# EAGLE design mymote-esp8266 (EAGLE 8.2.1)
PROJECT_AUTHOR: TINKERMAN <xose.perez@gmail.com>; PROJECT_LICENSE: CC-SA-BY 3.0; PROJECT_NAME: MYMOTE - ESP8266; PROJECT_VERSION: 0.1.20170507
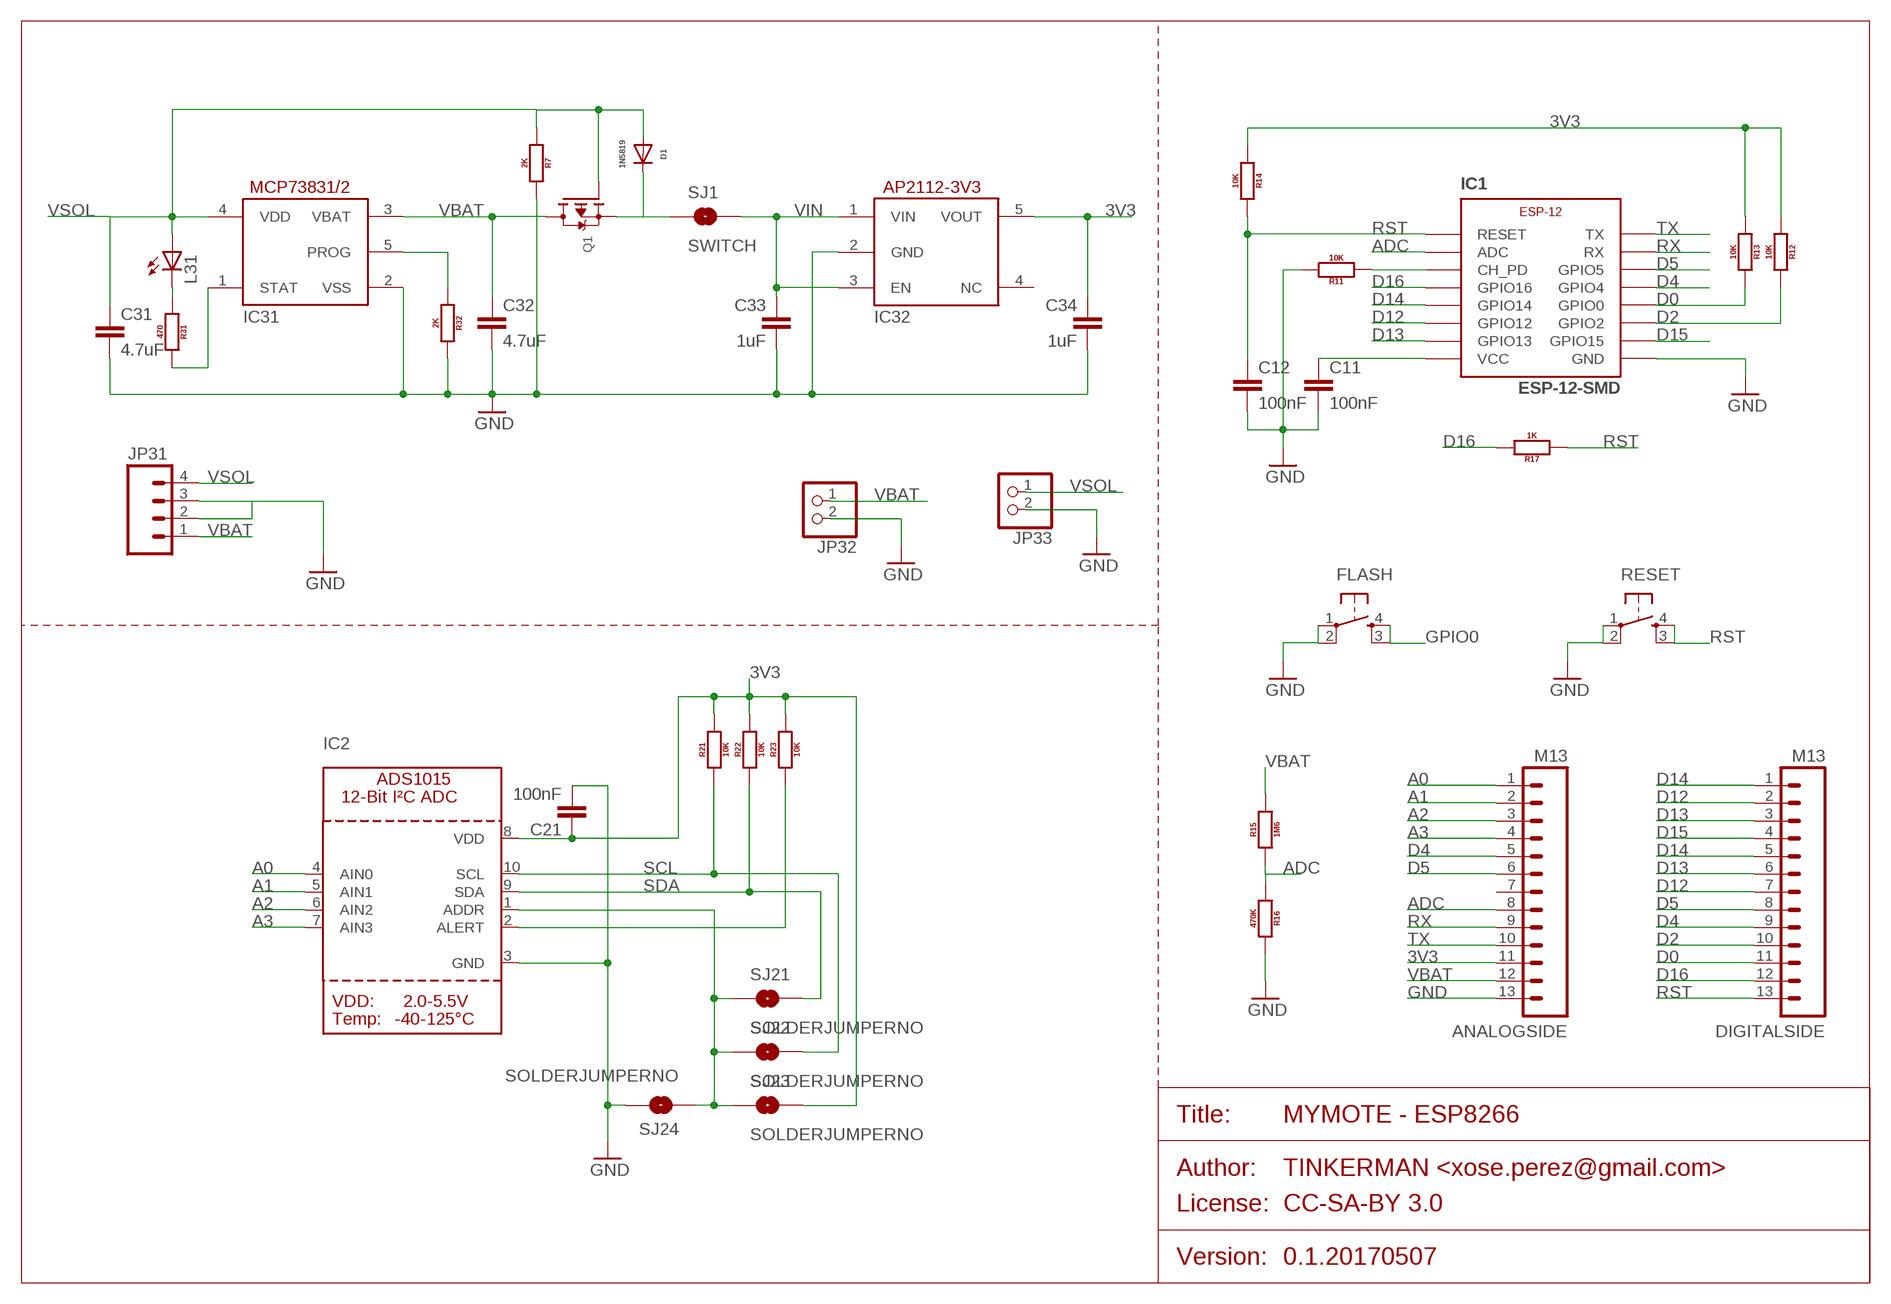
[diagram p0: schematic, sheet 1]

## Parts
ANALOGSIDE  M13  [1X13_NO_SILK]
C11  100nF  C-EU0805  [0805]
C12  100nF  C-EU0805  [0805]
C21  100nF  C-EU0805  [0805]
C31  4.7uF  C-EU0805  [0805]
C32  4.7uF  C-EU0805  [0805]
C33  1uF  C-EU0805  [0805]
C34  1uF  C-EU0805  [0805]
D1  1N5819  DIODE-SMD  [0805_DIODE]
DIGITALSIDE  M13  [1X13_NO_SILK]
FLASH  TACTILE_BUTTON_SMD  [TACTILE-BUTTON-SMD]
IC1  ESP-12-SMD  [ESP-12-SMD]
IC2  ADC_ADS1015  [MSOP10]
IC31  MCP73831/OT  [SOT23-5L]
IC32  AP2112-3V3  [SOT23-5L]
JP31  M04PTH  [1X04]
JP32  JST_2PIN-SMT-RA  [JST-PH-2-SMT-RA]
JP33  JST_2PIN-SMT-RA  [JST-PH-2-SMT-RA]
L31  LED_0805  [0805_DIODE]
Q1  MOSFET-PWIDE  [SOT23-WIDE]
R7  2K  RESISTOR0805  [0805]
R11  10K  RESISTOR0805  [0805]
R12  10K  RESISTOR0805  [0805]
R13  10K  RESISTOR0805  [0805]
R14  10K  RESISTOR0805  [0805]
R15  1M6  RESISTOR0805  [0805]
R16  470K  RESISTOR0805  [0805]
R17  1K  RESISTOR0805  [0805]
R21  10K  RESISTOR0805  [0805]
R22  10K  RESISTOR0805  [0805]
R23  10K  RESISTOR0805  [0805]
R31  470  RESISTOR0805  [0805]
R32  2K  RESISTOR0805  [0805]
RESET  TACTILE_BUTTON_SMD  [TACTILE-BUTTON-SMD]
SJ1  SWITCH  SOLDERJUMPERTRACE-PTH  [SJ_2S-TRACE-PTH]
SJ21  SOLDERJUMPERNO  [SJ_2S-NO]
SJ22  SOLDERJUMPERNO  [SJ_2S-NO]
SJ23  SOLDERJUMPERNO  [SJ_2S-NO]
SJ24  SOLDERJUMPERNO  [SJ_2S-NO]

## Nets
3V3: ANALOGSIDE.11 C11.1 C21.1 C34.1 IC1.VCC IC2.8(VDD) IC32.5(VOUT) R12.1 R13.1 R14.1 R21.2 R22.2 R23.2 SJ23.2
A0: ANALOGSIDE.1 IC2.4(AIN0)
A1: ANALOGSIDE.2 IC2.5(AIN1)
A2: ANALOGSIDE.3 IC2.6(AIN2)
A3: ANALOGSIDE.4 IC2.7(AIN3)
ADC: ANALOGSIDE.8 IC1.ADC R15.1 R16.1
D0: DIGITALSIDE.11 IC1.GPIO0 R13.2
D2: DIGITALSIDE.10 IC1.GPIO2 R12.2
D4: ANALOGSIDE.5 DIGITALSIDE.9 IC1.GPIO4
D5: ANALOGSIDE.6 DIGITALSIDE.8 IC1.GPIO5
D12: DIGITALSIDE.2 DIGITALSIDE.7 IC1.GPIO12
D13: DIGITALSIDE.3 DIGITALSIDE.6 IC1.GPIO13
D14: DIGITALSIDE.1 DIGITALSIDE.5 IC1.GPIO14
D15: DIGITALSIDE.4 IC1.GPIO15
D16: DIGITALSIDE.12 IC1.GPIO16 R17.2
GND [power]: ANALOGSIDE.13 C11.2 C12.2 C21.2 C31.2 C32.2 C33.2 C34.2 FLASH.1(SWA1) FLASH.2(SWB1) IC1.GND IC2.3(GND) IC31.2(VSS) IC32.2(GND) JP31.2 JP31.3 JP32.2 JP33.2 R7.2 R11.2 R16.2 R32.2 RESET.1(SWA1) RESET.2(SWB1) SJ24.2
GPIO0: FLASH.3(SWB2) FLASH.4(SWA2)
N$1: IC1.CH_PD R11.1
N$2: L31.C R31.1
N$3: IC31.5(PROG) R32.1
N$4: IC31.1(STAT) R31.2
N$9: D1.C Q1.2(S) SJ1.1
N$10: IC2.2(ALERT) R23.1
N$11: IC2.1(ADDR) SJ21.1 SJ22.1 SJ23.1 SJ24.1
RST: C12.1 DIGITALSIDE.13 IC1.RESET R14.2 R17.1 RESET.3(SWB2) RESET.4(SWA2)
RX: ANALOGSIDE.9 IC1.RX
SCL: IC2.10(SCL) R21.1 SJ22.2
SDA: IC2.9(SDA) R22.1 SJ21.2
TX: ANALOGSIDE.10 IC1.TX
VBAT: ANALOGSIDE.12 C32.1 IC31.3(VBAT) JP31.1 JP32.1 Q1.3(D) R15.2
VIN: C33.1 IC32.1(VIN) IC32.3(EN) SJ1.2
VSOL: C31.1 D1.A IC31.4(VDD) JP31.4 JP33.1 L31.A Q1.1(G) R7.1
Unconnected: ANALOGSIDE.7 IC32.4(NC)

## Library data of the parts
ANALOGSIDE DIGITALSIDE = xose:M13
C11 C12 C21 C31-C34 = xose:C-EU: CAPACITOR, European symbol
D1 = xose:DIODE
FLASH RESET = xose:TACTILE_BUTTON: Tactile Button SparkFun Electronics' Tactile Button COM-10302
IC1 = xose:ESP-12
IC2 = microbuilder:ADC_ADS1015: ADS1015 - 12-bit 4-Channel I2C ADC with Internal PGA VDD: 2.0-5.5V Sampling Rate: 3.3ksps Gain Settings: 2/3, 1, 2, 4, 8, 16 I2C Address: ADDR low = 1001000x, ADDR high = 1001001x Internal Comparator The ADS1015 includes an internal comparator that can be set to output a high-level on ALERT when the conversion results exceeeds a pre-defined upper level, and will deassert itself when the level falls below a pre-defined lower threshold level. It can also be set to windowed mode where the ALERT pin will be asserted if the data exceeds the upper threshold or falls below the lower threshold.
IC31 = adafruit:MCP73831: MCP73831/2 Miniature Single-Cell, Fully Integrated Li-Ion, Li-Polymer Charge Management Controllers. Nice and small simple lipoly charge controller, with adjustable current and status output (LED) http://www.ladyada.net/library/pcb/eaglelibrary.html
IC32 = xose:AP2112-3V3
JP31 = xose:M04: Header 4 Standard 4-pin 0.1" header. Use with straight break away headers (SKU : PRT-00116), right angle break away headers (PRT-00553), swiss pins (PRT-00743), machine pins (PRT-00117), and female headers (PRT-00115). Molex polarized connector foot print use with SKU : PRT-08231 with associated crimp pins and housings. 1MM SMD Version SKU: PRT-10208
JP32 JP33 = adafruit:JST_2PIN: JST 2-Pin Connectors of various flavors SMT-RA (S2B-PH-SM4) 4UConnector #17311 SMT (B2B-PH-SM4) THM-RA (S2B-PH) THM (B2B-PH)
L31 = xose:LED: LED OSRAM: - CHIPLED LG R971, LG N971, LY N971, LG Q971, LY Q971, LO R971, LY R971 LH N974, LH R974 LS Q976, LO Q976, LY Q976 LO Q996 - Hyper CHIPLED LW Q18S LB Q993, LB Q99A, LB R99A - SideLED LS A670, LO A670, LY A670, LG A670, LP A670 LB A673, LV A673, LT A673, LW A673 LH A674 LY A675 LS A676, LA A676, LO A676, LY A676, LW A676 LS A679, LY A679, LG A679 - Hyper Micro SIDELED® LS Y876, LA Y876, LO Y876, LY Y876 LT Y87S - SmartLED LW L88C, LW L88S LB L89C, LB L89S, LG L890 LS L89K, LO L89K, LY L89K LS L896, LA L896, LO L896, LY L896 - TOPLED LS T670, LO T670, LY T670, LG T670, LP T670 LSG T670, LSP T670, LSY T670, LOP T670, LYG T670 LG T671, LOG T671, LSG T671 LB T673, LV T673, LT T673, LW T673 LH T674 LS T676, LA T676, LO T676, LY T676, LB T676, LH T676, LSB T676, LW T676 LB T67C, LV T67C, LT T67C, LS T67K, LO T67K, LY T67K, LW E67C LS E67B, LA E67B, LO E67B, LY E67B, LB E67C, LV E67C, LT E67C LW T67C LS T679, LY T679, LG T679 LS T770, LO T770, LY T770, LG T770, LP T770 LB T773, LV T773, LT T773, LW T773 LH T774 LS E675, LA E675, LY E675, LS T675 LS T776, LA T776, LO T776, LY T776, LB T776 LHGB T686 LT T68C, LB T68C - Hyper Mini TOPLED® LB M676 - Mini TOPLED Santana® LG M470 LS M47K, LO M47K, LY M47K Source: http://www.osram.convergy.de LUXEON: - LUMILED® LXK2-PW12-R00, LXK2-PW12-S00, LXK2-PW14-U00, LXK2-PW14-V00 LXK2-PM12-R00, LXK2-PM12-S00, LXK2-PM14-U00 LXK2-PE12-Q00, LXK2-PE12-R00, LXK2-PE12-S00, LXK2-PE14-T00, LXK2-PE14-U00 LXK2-PB12-K00, LXK2-PB12-L00, LXK2-PB12-M00, LXK2-PB14-N00, LXK2-PB14-P00, LXK2-PB14-Q00 LXK2-PR12-L00, LXK2-PR12-M00, LXK2-PR14-Q00, LXK2-PR14-R00 LXK2-PD12-Q00, LXK2-PD12-R00, LXK2-PD12-S00 LXK2-PH12-R00, LXK2-PH12-S00 LXK2-PL12-P00, LXK2-PL12-Q00, LXK2-PL12-R00 Source: www.luxeon.com KINGBRIGHT: KA-3528ASYC Source: www.kingbright.com
Q1 = xose:MOSFET-P: P-Channel Mosfet LEGEND VDS: Voltage Drain-Source ID: Drain Current RDS(ON): Drain-Source On-State Resistance VGS(TH): Gate-Source Threshold Voltage CISS: Drain-Source Input Capacitance SOT-23 Name VDS ID RDS(ON) VGS(TH) CISS Order Number IRLML5103 30V 760mA 600 mOhm -- 75pF @ 25V Digikey: IRLML5103PBFCT-ND IRLML6401 12V 4.3A 50 mOhm 950mV @ 250µA 830pF @ 10V Digikey: IRLML6401PBFTR-ND NTR0202PL 20V 400mA 800 mOhm 2.3V @ 250uA 70pF @ 5V Digikey: NTR0202PLT1GOSTR-ND NTR4101PT1G 20V 1.8A 85 mOhm 1.2V @ 250uA 675pF @ 10V Digikey: NTR4101PT1GOSCT-ND DMP2004K 20V 600mA 900 mOhm 1V @ 250uA 175pF @ 16V Digikey: DMP2004KDICT-ND PMV65XP 20V 3.9A 76 mOhm 950mV @ 1mA 725pF @ 20V Digikey: 568-2358-2-ND TO-252 Name VDS ID RDS(ON) VGS(TH) CISS Order Number AOD417 30V 25A 34 mOhm 3V @ 250µA 920pF @ 15V Digikey: 785-1106-2-ND
R7 R11-R17 R21-R23 R31 R32 = xose:RESISTOR: Generic EU resistor symbol
SJ1 SJ21-SJ24 = xose:SOLDERJUMPER: Solder Jumper Standard SMD solder jumper. Used to automate production. Two varients : Normally Open and Normally Closed are the same, but have different paste layers. NC will have a large amount of paste and should jumper during reflow.

## Net classes
1 power: width 0.381 mm, clearance 0.254 mm

## Board
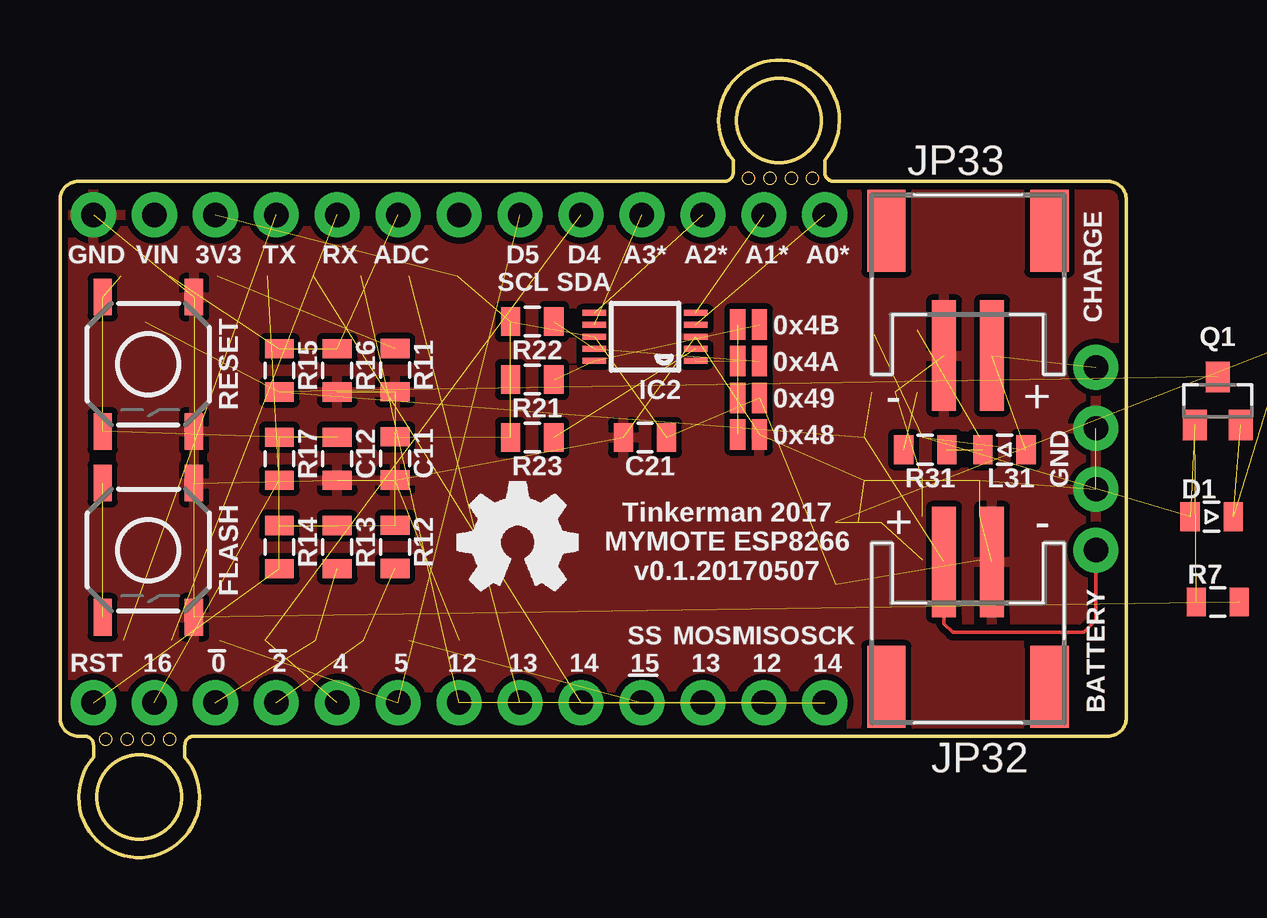
[diagram p1: board, top side]
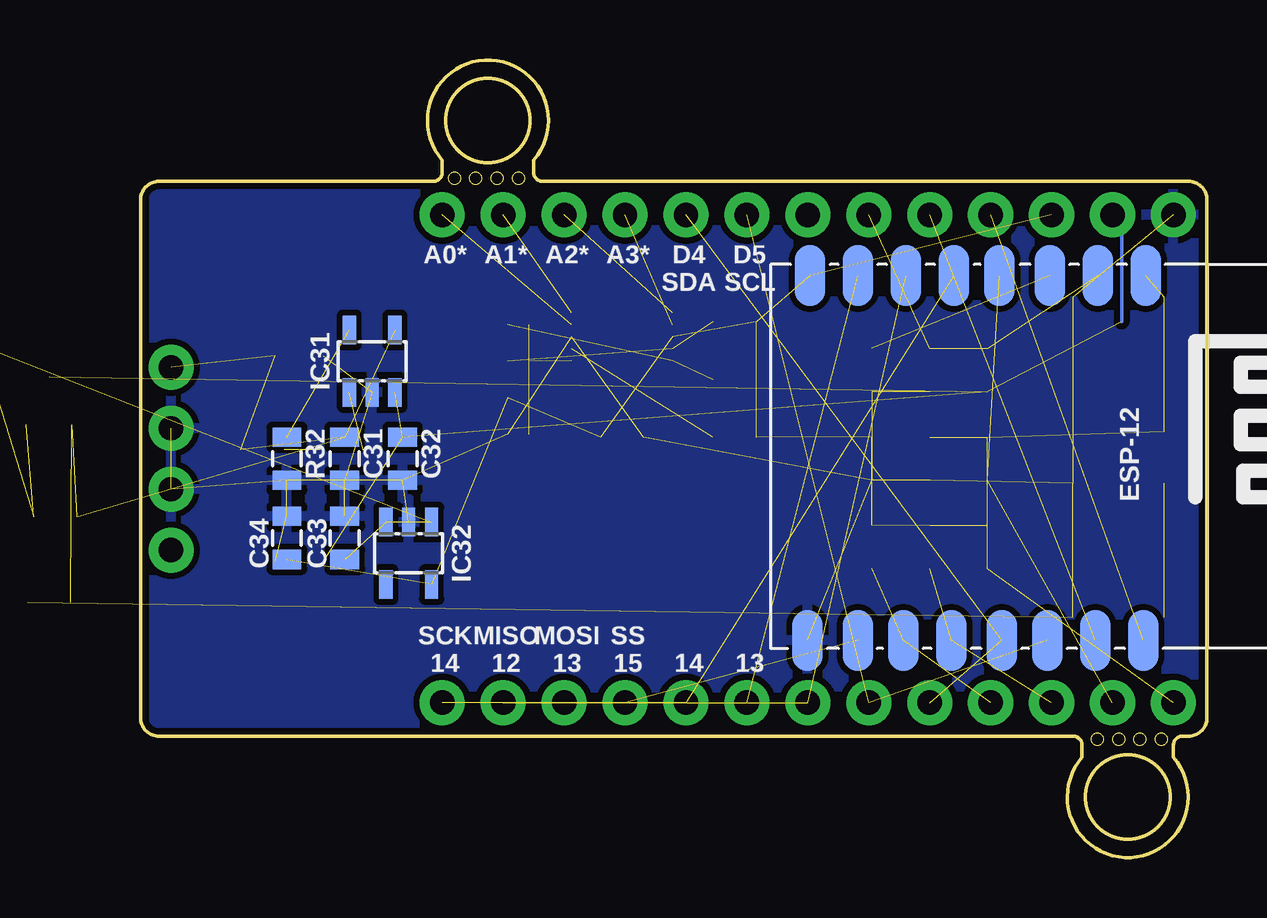
[diagram p2: board, bottom side, seen from below]

Size 44.45 x 33.23 mm. Coordinates in mm from the lower left corner, seen from the top.
Outline: 0.71,5.06 0.76,5.06
Outline: 0.76,28.17 0.71,28.17
Outline: 0,5.77 0,5.82
Outline: 0,27.41 0,27.46
Outline: 0,5.82 0,27.41
Outline: 0,27.41 arc-90 0.76,28.17
Outline: 0.76,5.06 1.02,5.06 arc-90 1.4,4.68 1.4,4.17 arc262 5.21,4.17 5.21,4.68 arc-90 5.59,5.06 43.69,5.06 arc90 44.45,5.82 44.45,27.41 arc90 43.69,28.17 32.26,28.17 arc-90 31.88,28.55 31.88,29.06 arc262 28.07,29.06 28.07,28.55 arc-90 27.69,28.17 0.76,28.17
Outline: 0.76,5.06 arc-90 0,5.82
Outline: circle at 3.3,2.52 radius 1.75
Outline: circle at 1.91,4.93 radius 0.25
Outline: circle at 2.79,4.93 radius 0.25
Outline: circle at 3.68,4.93 radius 0.25
Outline: circle at 29.97,30.71 radius 1.75
Outline: circle at 31.37,28.3 radius 0.25
Outline: circle at 30.48,28.3 radius 0.25
Outline: circle at 29.59,28.3 radius 0.25
Outline: circle at 4.57,4.93 radius 0.25
Outline: circle at 28.7,28.3 radius 0.25
Copper layers (1*16): Top 0.035mm / dielectric 1.5mm / Bottom 0.035mm
Design rules "seedstudio-2layer": minimum track width 6mil, minimum drill 12mil, track to track 6mil, track to pad 6mil, pad to pad 6mil, via to via 6mil, smd to smd 0mil, copper to edge 10mil, drill to drill 10mil, minimum pad ring 10mil, minimum via ring 6mil, stop-mask expansion 2mil, vias tented up to drill 100mil, thermal gap 10mil

### Footprints (pad centres in the part's own frame; a part is rotated, then mirrored left to right if it is on the bottom)
1X13_NO_SILK = drill 1.016 pad 1.88: 1 0,0; 2 2.54,0; 3 5.08,0; 4 7.62,0; 5 10.16,0; 6 12.7,0; 7 15.24,0; 8 17.78,0; 9 20.32,0; 10 22.86,0; 11 25.4,0; 12 27.94,0; 13 30.48,0
0805 = smd 0.8 x 1.2: 1 -0.9,0; 2 0.9,0
0805_DIODE = smd 0.8 x 1.2: A -0.9,0; C 0.9,0
TACTILE-BUTTON-SMD = smd 1.524 x 0.762: 1 -2.794,1.905; 2 2.794,1.905; 3 -2.794,-1.905; 4 2.794,-1.905
ESP-12-SMD = smd 2.54 x 1.27: ADC -7,5.1; CH_PD -7,3.1; GND 8.2,-7; GPIO0 8.2,-1; GPIO2 8.2,-3; GPIO4 8.2,1.1; GPIO5 8.2,3; GPIO12 -7,-2.9; GPIO13 -7,-4.9; GPIO14 -7,-0.9; GPIO15 8.2,-4.9; GPIO16 -7,1; RESET -7,7.1; RX 8.2,5; TX 8.2,7; VCC -7,-6.9
MSOP10 = smd 0.241 x 0.991: 1 -1,-2.113; 2 -0.5,-2.113; 3 0,-2.113; 4 0.5,-2.113; 5 1,-2.113; 6 1,2.113; 7 0.5,2.113; 8 0,2.113; 9 -0.5,2.113; 10 -1,2.113
SOT23-5L = smd 0.55 x 1.2: 1 -0.95,-1.3; 2 0,-1.3; 3 0.95,-1.3; 4 0.95,1.3; 5 -0.95,1.3
1X04 = drill 1.016 pad 1.88: 1 0,0; 2 2.54,0; 3 5.08,0; 4 7.62,0
JST-PH-2-SMT-RA = smd 1 x 4.6: 1 1,-3.7; 2 -1,-3.7 | smd 1.6 x 3.4: NC1 -3.4,1.5; NC2 3.4,1.5
SOT23-WIDE = smd 1 x 1.27: 1 -0.95,-1; 2 0.95,-1; 3 0,1
SJ_2S-TRACE-PTH = drill 1.016 pad 1.778: 1 -1.27,0; 2 1.27,0 | smd 1.27 x 0.381 bottom: P$1 0,0
SJ_2S-NO = smd 0.635 x 1.27: 1 -0.45,0; 2 0.45,0

### Placement (x,y rotation side)
ANALOGSIDE  31.88,26.77 180 top
C11  13.97,16.63 270 top
C12  11.56,16.61 270 top
C21  24.38,17.5 180 top
C31  35.94,16.61 270 bottom
C32  33.53,16.61 270 bottom
C33  35.94,13.31 90 bottom
C34  38.35,13.31 90 bottom
D1  48.01,14.2 0 top
DIGITALSIDE  31.88,6.45 180 top
FLASH  3.68,12.8 270 top
IC1  9.65,17.25 270 bottom
IC2  24.38,21.69 90 top
IC31  34.8,20.68 0 bottom
IC32  33.27,12.68 180 bottom
JP31  43.18,12.8 90 top
JP32  37.85,8.61 180 top
JP33  37.85,24.62 0 top
L31  39.37,17 180 top
Q1  48.26,19.03 0 top
R7  48.26,10.65 0 top
R11  13.97,20.31 270 top
R12  13.97,12.94 270 top
R13  11.56,12.93 270 top
R14  9.14,12.93 270 top
R15  9.14,20.3 270 top
R16  11.56,20.3 270 top
R17  9.14,16.61 270 top
R21  19.68,19.92 180 top
R22  19.68,22.33 180 top
R23  19.68,17.5 180 top
R31  36.07,17 180 top
R32  38.35,16.61 270 bottom
RESET  3.68,20.55 270 top
SJ1  52.7,22.46 0 top  (outside the outline)
SJ21  28.7,20.68 0 top
SJ22  28.7,22.2 0 top
SJ23  28.7,19.15 0 top
SJ24  28.7,17.63 0 top

### Tracks (layer width: path | path; a pad name or v marks a point on that pad's centre or on a via)
3V3  (13 unrouted)
A0  (1 unrouted)
A1  (1 unrouted)
A2  (1 unrouted)
A3  (1 unrouted)
ADC  (3 unrouted)
D0  (2 unrouted)
D2  (2 unrouted)
D4  (2 unrouted)
D5  (2 unrouted)
D12  (2 unrouted)
D13  (2 unrouted)
D14  (2 unrouted)
D15  (1 unrouted)
D16  (2 unrouted)
GND  (24 unrouted)
  pour Top (isolate 0.025): -0.76,29.7 44.83,29.7 44.96,4.55 -0.64,4.55
  pour Bottom (isolate 0.025): -0.13,28.93 44.58,28.93 44.45,4.8 -0.25,4.8
GPIO0  (1 unrouted)
N$1  (1 unrouted)
N$2  (1 unrouted)
N$3  (1 unrouted)
N$4  (1 unrouted)
N$9  (2 unrouted)
N$10  (1 unrouted)
N$11  (4 unrouted)
RST  (6 unrouted)
  Bottom 0.152: IC1.RESET 2.55,24.23
RX  (1 unrouted)
SCL  (2 unrouted)
SDA  (2 unrouted)
TX  (1 unrouted)
VBAT  (5 unrouted)
  Top 0.152: JP32.1 36.85,9.74 37.21,9.38 42.67,9.38 43.18,9.88 JP31.1
  Bottom 0.152: ANALOGSIDE.12 3.56,26.39 3.56,22.33
VIN  (3 unrouted)
VSOL  (7 unrouted)

### Text on the board
tNames: GND | VIN | 3V3 | TX | RX | ADC | D5 / SCL | D4 / SDA | A3* | A2* | A1* | A0* | CHARGE | 0x4B | 0x4A | 0x49 | 0x48 | GND | Tinkerman 2017 / MYMOTE ESP8266 / v0.1.20170507 | BATTERY | RST | 16 | 0 | 2 | 4 | 5 | 12 | 13 | 14 | SS / 15 | MOSI / 13 | MISO / 12 | SCK / 14
bNames: D5 / SCL | D4 / SDA | A3* | A2* | A1* | A0* | 13 | 14 | SS / 15 | MOSI / 13 | MISO / 12 | SCK / 14
tValues: GND